# Altium schematic sheet Sensor-RGB.SchDoc
size A; DocumentNumber: 4; SheetNumber: 4
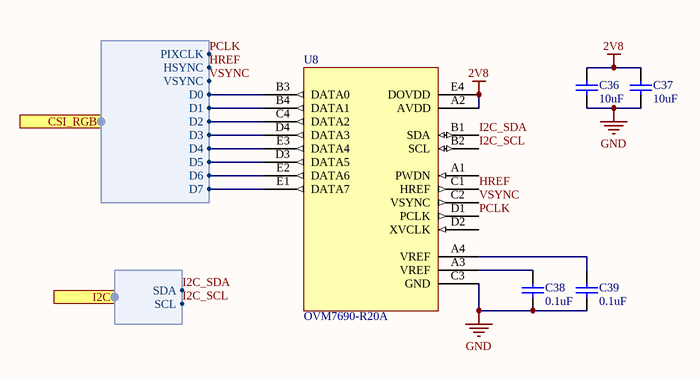
[diagram p0: Sensor-RGB.SchDoc]

## Parts
C36  value 10uF  [C0402[1005X55]]  (hidden comment: 10uF 6.3V 0402)
C37  value 10uF  [C0402[1005X55]]  (hidden comment: 10uF 6.3V 0402)
C38  value 0.1uF  [C0201[0603X30]]  (hidden comment: 0.1uF 6.3V 0201)
C39  value 0.1uF  [C0201[0603X30]]  (hidden comment: 0.1uF 6.3V 0201)
U8  OVM7690-R20A

## Ports
CSI_RGB (harness CSI), I2C (harness I2C)

## Harnesses
CSI: D2, D3, D1, D0, D6, D7, D5, D4, PIXCLK, HSYNC, VSYNC
I2C: SCL, SDA

## Nets
2V8: C36.2 C37.2 U8.A2(AVDD) U8.E4(DOVDD)
GND: C36.1 C37.1 C38.1 C39.1 U8.C3(GND)
HREF: U8.C1(HREF) ; port CSI_RGB.HSYNC
I2C_SCL: U8.B2(SCL) ; port I2C.SCL
I2C_SDA: U8.B1(SDA) ; port I2C.SDA
PCLK: U8.D1(PCLK) ; port CSI_RGB.PIXCLK
VSYNC: U8.C2(VSYNC) ; port CSI_RGB.VSYNC
NetC38_2: C38.2 U8.A3(VREF)
NetC39_2: C39.2 U8.A4(VREF)
NetU8_B3: U8.B3(DATA0) ; port CSI_RGB.D0
NetU8_B4: U8.B4(DATA1) ; port CSI_RGB.D1
NetU8_C4: U8.C4(DATA2) ; port CSI_RGB.D2
NetU8_D3: U8.D3(DATA5) ; port CSI_RGB.D5
NetU8_D4: U8.D4(DATA3) ; port CSI_RGB.D3
NetU8_E1: U8.E1(DATA7) ; port CSI_RGB.D7
NetU8_E2: U8.E2(DATA6) ; port CSI_RGB.D6
NetU8_E3: U8.E3(DATA4) ; port CSI_RGB.D4

Not connected (* = marked no-connect by the designer): U8 A1(PWDN) D2(XVCLK)

## Library data of the parts
C36 C37 = CAP_10uF_6.3V_0402_20%: 10uF 6.3V 20% 0402 (1005 Metric); PartNumber: GRM155R60J106ME44D; Manufacturer: Murata; Mounting Technology: Surface Mount; PackageReference: 0402; PackageDescription: 0402 (1005 Metric); Voltage: 6.3V; Tolerance: 20%
C38 C39 = CAP_0.1uF_6.3V_0201_10%: 0.1uF 6.3V 10% 0201 (0603 Metric); PartNumber: GRT033R60J104KE01D; Manufacturer: Murata; Mounting Technology: Surface Mount; PackageReference: 0201; PackageDescription: 0201 (0603 Metric); Voltage: 6.3V; Tolerance: 10%
U8 = OVM7690-R20A: SENSOR CAMERA CMOS 20CAMERACUBE; Manufacturer: OmniVision Technologies; PartNumber: OVM7690-R20A; PackageReference: 20-CAMERACUBE; Mounting Technology: Surface Mount